# Altium schematic sheet DC075B_JESD_OUTPUT.SchDoc: JESD OUTPUT
size 558 x 431 mm; DrawnBy: Praveen Aroul; DocumentNumber: 11; SheetNumber: 11; SheetTotal: 13; PageSetup: Record=PageOptions|CenterHorizontal=True|CenterVertical=True|PrintScale=1.00|XCorrection=1.00|YCorrection=1.00|PrintKind=0|BorderSize=5000000|LeftOffset=0|BottomOffset=0|Orientation=2|PaperLength=1000|PaperWidth=1000|Scale=100|PaperSource=15|PrintQuality=600|MediaType=1|DitherType=10|PaperKind=Letter|PrintScaleMode=1
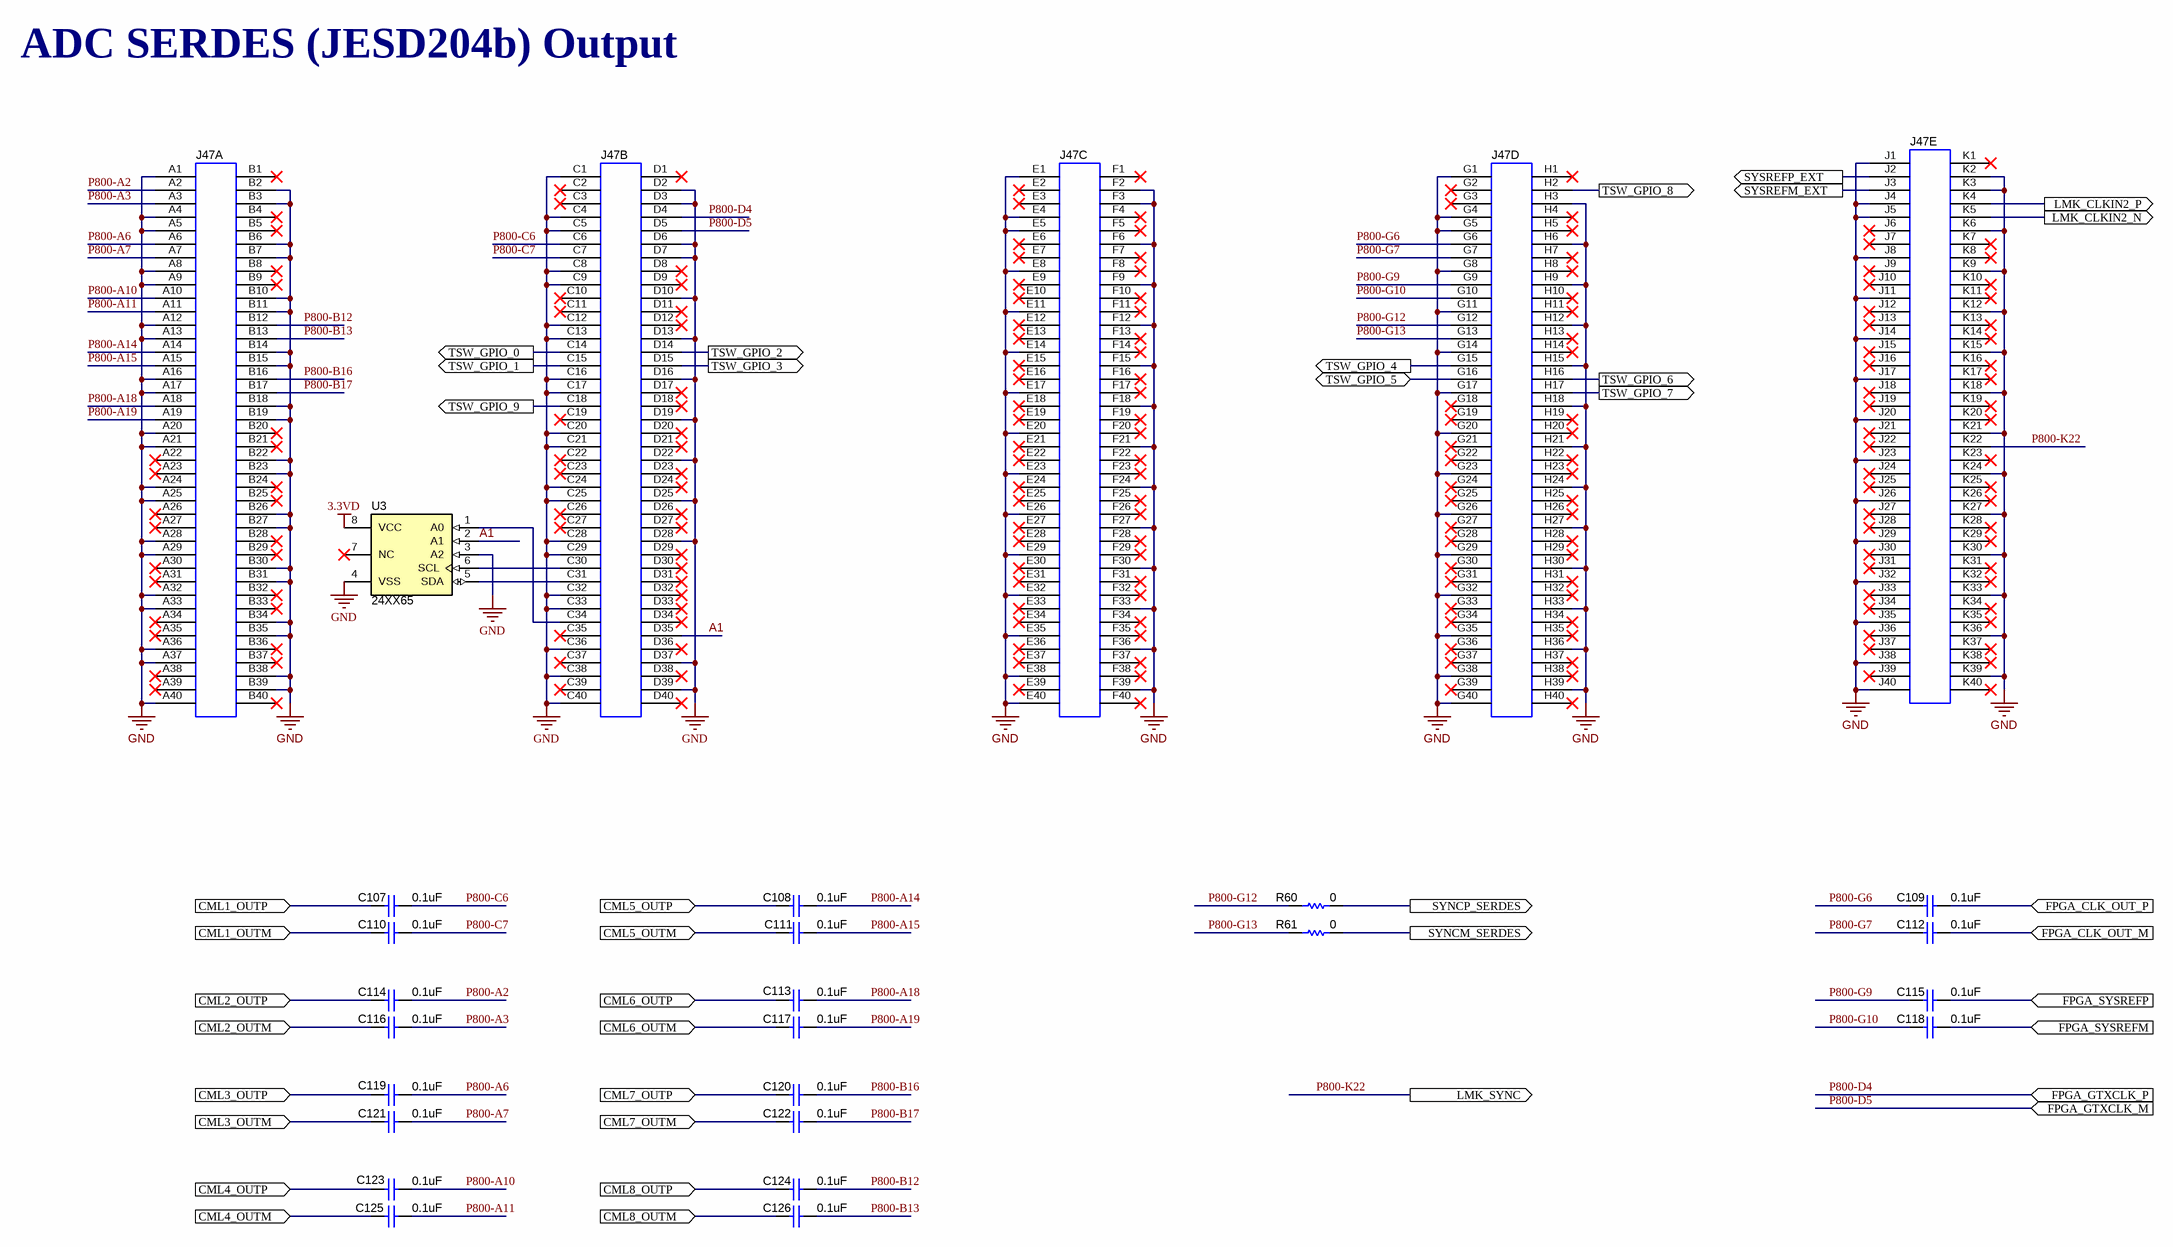
[diagram p0: DC075B_JESD_OUTPUT.SchDoc]

## Parts
C107  value 0.1uF  [0402]  (hidden comment: Capacitor)
C108  value 0.1uF  [0402]  (hidden comment: Capacitor)
C109  value 0.1uF  [0402]  (hidden comment: Capacitor)
C110  value 0.1uF  [0402]  (hidden comment: Capacitor)
C111  value 0.1uF  [0402]  (hidden comment: Capacitor)
C112  value 0.1uF  [0402]  (hidden comment: Capacitor)
C113  value 0.1uF  [0402]  (hidden comment: Capacitor)
C114  value 0.1uF  [0402]  (hidden comment: Capacitor)
C115  value 0.1uF  [0402]  (hidden comment: Capacitor)
C116  value 0.1uF  [0402]  (hidden comment: Capacitor)
C117  value 0.1uF  [0402]  (hidden comment: Capacitor)
C118  value 0.1uF  [0402]  (hidden comment: Capacitor)
C119  value 0.1uF  [0402]  (hidden comment: Capacitor)
C120  value 0.1uF  [0402]  (hidden comment: Capacitor)
C121  value 0.1uF  [0402]  (hidden comment: Capacitor)
C122  value 0.1uF  [0402]  (hidden comment: Capacitor)
C123  value 0.1uF  [0402]  (hidden comment: Capacitor)
C124  value 0.1uF  [0402]  (hidden comment: Capacitor)
C125  value 0.1uF  [0402]  (hidden comment: Capacitor)
C126  value 0.1uF  [0402]  (hidden comment: Capacitor)
J47  SAMTEC_ASP-134602-01  [SAMTEC_ASP-134602-01]  (value not drawn)  (parts A,B,C,D,E of 5)
R60  value 0  [0402]  (hidden comment: Resistor)
R61  value 0  [0402]  (hidden comment: Resistor)
U3  24XX65  [SOIC127P800X216-8N]

## Ports
CML1_OUTM (in), CML1_OUTP (in), CML2_OUTM (in), CML2_OUTP (in), CML3_OUTM (in), CML3_OUTP (in), CML4_OUTM (in), CML4_OUTP (in), CML5_OUTM (in), CML5_OUTP (in), CML6_OUTM (in), CML6_OUTP (in), CML7_OUTM (in), CML7_OUTP (in), CML8_OUTM (in), CML8_OUTP (in), FPGA_CLK_OUT_M (in), FPGA_CLK_OUT_P (in), FPGA_GTXCLK_M (in), FPGA_GTXCLK_P (in), FPGA_SYSREFM (in), FPGA_SYSREFP (in), LMK_CLKIN2_N (out), LMK_CLKIN2_P (out), LMK_SYNC (out), SYNCM_SERDES (out), SYNCP_SERDES (out), SYSREFM_EXT (out), SYSREFP_EXT (out), TSW_GPIO_0 (out), TSW_GPIO_1 (out), TSW_GPIO_2 (out), TSW_GPIO_3 (out), TSW_GPIO_4 (out), TSW_GPIO_5, TSW_GPIO_6 (out), TSW_GPIO_7 (out), TSW_GPIO_8 (out), TSW_GPIO_9 (out)

## Nets
3.3VD: U3.8(VCC)
GND: J47.A1 J47.A4 J47.A5 J47.A8 J47.A9 J47.A12 J47.A13 J47.A16 J47.A17 J47.A20 J47.A21 J47.A24 J47.A25 J47.A28 J47.A29 J47.A32 J47.A33 J47.A36 J47.A37 J47.A40 J47.B2 J47.B3 J47.B6 J47.B7 J47.B10 J47.B11 J47.B14 J47.B15 J47.B18 J47.B19 J47.B22 J47.B23 J47.B26 J47.B27 J47.B30 J47.B31 J47.B34 J47.B35 J47.B38 J47.B39 J47.C1 J47.C4 J47.C5 J47.C8 J47.C9 J47.C12 J47.C13 J47.C16 J47.C17 J47.C20 J47.C21 J47.C24 J47.C25 J47.C28 J47.C29 J47.C32 J47.C33 J47.C36 J47.C38 J47.C40 J47.D2 J47.D3 J47.D6 J47.D7 J47.D10 J47.D13 J47.D16 J47.D19 J47.D22 J47.D25 J47.D28 J47.D37 J47.D39 J47.E1 J47.E4 J47.E5 J47.E8 J47.E11 J47.E14 J47.E17 J47.E20 J47.E23 J47.E26 J47.E29 J47.E32 J47.E35 J47.E38 J47.E40 J47.F2 J47.F3 J47.F6 J47.F9 J47.F12 J47.F15 J47.F18 J47.F21 J47.F24 J47.F27 J47.F30 J47.F33 J47.F36 J47.F39 J47.G1 J47.G4 J47.G5 J47.G8 J47.G11 J47.G14 J47.G17 J47.G20 J47.G23 J47.G26 J47.G29 J47.G32 J47.G35 J47.G38 J47.G40 J47.H3 J47.H6 J47.H9 J47.H12 J47.H15 J47.H18 J47.H21 J47.H24 J47.H27 J47.H30 J47.H33 J47.H36 J47.H39 J47.J1 J47.J4 J47.J5 J47.J8 J47.J11 J47.J14 J47.J17 J47.J20 J47.J23 J47.J26 J47.J29 J47.J32 J47.J35 J47.J38 J47.J40 J47.K2 J47.K3 J47.K6 J47.K9 J47.K12 J47.K15 J47.K18 J47.K21 J47.K24 J47.K27 J47.K30 J47.K33 J47.K36 J47.K39 U3.3(A2) U3.4(VSS)
A1: J47.D35 U3.2(A1)
CML1_OUTM: C110.2 ; port CML1_OUTM
CML1_OUTP: C107.2 ; port CML1_OUTP
CML2_OUTM: C116.2 ; port CML2_OUTM
CML2_OUTP: C114.2 ; port CML2_OUTP
CML3_OUTM: C121.2 ; port CML3_OUTM
CML3_OUTP: C119.2 ; port CML3_OUTP
CML4_OUTM: C125.2 ; port CML4_OUTM
CML4_OUTP: C123.2 ; port CML4_OUTP
CML5_OUTM: C111.2 ; port CML5_OUTM
CML5_OUTP: C108.2 ; port CML5_OUTP
CML6_OUTM: C117.2 ; port CML6_OUTM
CML6_OUTP: C113.2 ; port CML6_OUTP
CML7_OUTM: C122.2 ; port CML7_OUTM
CML7_OUTP: C120.2 ; port CML7_OUTP
CML8_OUTM: C126.2 ; port CML8_OUTM
CML8_OUTP: C124.2 ; port CML8_OUTP
FPGA_CLK_OUT_M: C112.1 ; port FPGA_CLK_OUT_M
FPGA_CLK_OUT_P: C109.1 ; port FPGA_CLK_OUT_P
FPGA_SYSREFM: C118.1 ; port FPGA_SYSREFM
FPGA_SYSREFP: C115.1 ; port FPGA_SYSREFP
LMK_CLKIN2_N: J47.K5 ; port LMK_CLKIN2_N
LMK_CLKIN2_P: J47.K4 ; port LMK_CLKIN2_P
P800-A2: C114.1 J47.A2
P800-A3: C116.1 J47.A3
P800-A6: C119.1 J47.A6
P800-A7: C121.1 J47.A7
P800-A10: C123.1 J47.A10
P800-A11: C125.1 J47.A11
P800-A14: C108.1 J47.A14
P800-A15: C111.1 J47.A15
P800-A18: C113.1 J47.A18
P800-A19: C117.1 J47.A19
P800-B12: C124.1 J47.B12
P800-B13: C126.1 J47.B13
P800-B16: C120.1 J47.B16
P800-B17: C122.1 J47.B17
P800-C6: C107.1 J47.C6
P800-C7: C110.1 J47.C7
P800-D4: J47.D4 ; port FPGA_GTXCLK_P
P800-D5: J47.D5 ; port FPGA_GTXCLK_M
P800-G6: C109.2 J47.G6
P800-G7: C112.2 J47.G7
P800-G9: C115.2 J47.G9
P800-G10: C118.2 J47.G10
P800-G12: J47.G12 R60.1
P800-G13: J47.G13 R61.1
P800-K22: J47.K22 ; port LMK_SYNC
SYNCM_SERDES: R61.2 ; port SYNCM_SERDES
SYNCP_SERDES: R60.2 ; port SYNCP_SERDES
SYSREFM_EXT: J47.J3 ; port SYSREFM_EXT
SYSREFP_EXT: J47.J2 ; port SYSREFP_EXT
TSW_GPIO_0: J47.C14 ; port TSW_GPIO_0
TSW_GPIO_1: J47.C15 ; port TSW_GPIO_1
TSW_GPIO_2: J47.D14 ; port TSW_GPIO_2
TSW_GPIO_3: J47.D15 ; port TSW_GPIO_3
TSW_GPIO_4: J47.G15 ; port TSW_GPIO_4
TSW_GPIO_5: J47.G16 ; port TSW_GPIO_5
TSW_GPIO_6: J47.H16 ; port TSW_GPIO_6
TSW_GPIO_7: J47.H17 ; port TSW_GPIO_7
TSW_GPIO_8: J47.H2 ; port TSW_GPIO_8
TSW_GPIO_9: J47.C18 ; port TSW_GPIO_9
NetJ47_C30: J47.C30 U3.6(SCL)
NetJ47_C31: J47.C31 U3.5(SDA)
NetJ47_C34: J47.C34 U3.1(A0)

Not connected (* = marked no-connect by the designer): J47 A22* A23* A26* A27* A30* A31* A34* A35* A38* A39* B1* B4* B5* B8* B9* B20* B21* B24* B25* B28* B29* B32* B33* B36* B37* B40* C2* C3* C10* C11* C19* C22* C23* C26* C27* C35* C37* C39* D1* D8* D9* D11* D12* D17* D18* D20* D21* D23* D24* D26* D27* D29* D30* D31* D32* D33* D34* D36* D38* D40* E2* E3* E6* E7* E9* E10* E12* E13* E15* E16* E18* E19* E21* E22* E24* E25* E27* E28* E30* E31* E33* E34* E36* E37* E39* F1* F4* F5* F7* F8* F10* F11* F13* F14* F16* F17* F19* F20* F22* F23* F25* F26* F28* F29* F31* F32* F34* F35* F37* F38* F40* G2* G3* G18* G19* G21* G22* G24* G25* G27* G28* G30* G31* G33* G34* G36* G37* G39* H1* H4* H5* H7* H8* H10* H11* H13* H14* H19* H20* H22* H23* H25* H26* H28* H29* H31* H32* H34* H35* H37* H38* H40* J6* J7* J9* J10* J12* J13* J15* J16* J18* J19* J21* J22* J24* J25* J27* J28* J30* J31* J33* J34* J36* J37* J39* K1* K7* K8* K10* K11* K13* K14* K16* K17* K19* K20* K23* K25* K26* K28* K29* K31* K32* K34* K35* K37* K38* K40*; U3 7(NC)*

## Notes on the sheet
- ADC SERDES (JESD204b) Output
- Drawn By:
- SVN Rev:
- Number:
- TID #:
- Orderable:
- Rev:
- Sheet Title:
- File:
- Project Title:
- Designed for:
- Assembly Variant:
- Mod. Date:
- Sheet:
- Size:
- of
- C
- http://www.ti.com
- Texas Instruments and/or its licensors do not warrant the accuracy or completeness of this specification or any information contained therein. Texas Instruments and/or its licensors do not warrant that this design will meet the specifications, will be suitable for your application or fit for any particular purpose, or will operate in an implementation. Texas Instruments and/or its licensors do not warrant that the design is production worthy. You should completely validate and test your design implementation to confirm the system functionality for your application.
- Engineer:
- Contact:
- © Texas Instruments

## Library data of the parts
C107-C126 = CMP-0006641-2: CAP, CERM, 0.1 uF, 16 V, +/- 10%, X7R, 0402; PartNumber: GRM155R71C104KA88D; Manufacturer: MuRata; Polarized: N; U/M: EA; Cap_F: 100nF; Value1: Unknown; VDC_V: 16V; TaMin_C: -55°C; TaMax_C: 125°C; AEC Category: Q200; SizeArea_mm2: 0.5; SizeAreaWB_mm2: 3; SizeX_mm: 1; SizeZ_mm: 0.6; CompType: Capacitor; ValueDisplayed: 0.1uF; PackageReference: 0402; RoHS: Y; Tolerance_%: 10%; Value2: 16V; MountType: SMT; Technology: Ceramic; TempCo: X7R; Cap_Case: 0402; Published: 2008-06-19; Publisher: Texas Instruments; LatestRevisionDate: 2017-03-09; ComponentLink1Description: Datasheet link; ComponentLink1URL: http://search.murata.co.jp/Ceramy/PnsearchViewAction.do?HnOFG=ON&HnNFG=ON&SEL_CNT=50&sLang=en&sKey=GRM155R71C104KA88D&x=9&y=9&search=startwith; Supplier 1: Digi-Key; Supplier Part Number 1: 490-3261-1-ND; Supplier 2: Newark; Supplier Part Number 2: 38K1647; Supplier 3: Mouser; Supplier Part Number 3: 81-GRM155R71C104KA88; AEC Qualified: ?; SizeY_mm: 0.5
J47 = CMP-0056027-1: Connector, Male, 1.27 mm, 40x4, SMD; Manufacturer: Samtec; CNHeader: FALSE; PartNumber: ASP-134602-01; PackageReference: Connector, Male, 1.27 mm, 40x4, SMD; CompType: Connector; RoHS: Y; MountType: SMT; ComponentLink1Description: Datasheet URL; ComponentLink1URL: http://www.samtec.com/documents/webfiles/Cpdf/ASP-134602-01-mkt.pdf; Publisher: Texas Instruments; LatestRevisionDate: 26/05/2017; Supplier 1: Digi-Key; Supplier Part Number 1: SAM8731-ND; Supplier 2: Farnell; Supplier Part Number 2: 2433505; CT: FALSE
R60 R61 = CMP-0026822-3: RES, 0, 5%, 0.063 W, AEC-Q200 Grade 0, 0402; Manufacturer: Vishay-Dale; PartNumber: CRCW04020000Z0ED; Value_Code: 0000; Power_W: 63mW; Value2: 0.063W; VDC_V: 50V; TempCo: 200 ppm/C; EIA_Code: E24; AEC Category: Q200; AEC Qualified: Y; SizeArea_mm2: 0.5; SizeX_mm: 1; SizeZ_mm: 0.6; ComponentLink1Description: Datasheet link; ComponentLink1URL: http://www.vishay.com/docs/20035/dcrcwe3.pdf; CompType: Resistor; MountType: SMT; PackageReference: 0402; RoHS: E; ValueDisplayed: 0; Res_ohm: 0; Tolerance_%: 5%; Value1: 5%; Technology: Thick Film; Supplier 1: Digi-Key; Supplier Part Number 1: 541-0.0JCT-ND; Supplier 2: Newark; Supplier Part Number 2: 52K6543; Supplier 3: Mouser; Supplier Part Number 3: 71-CRCW0402-0-E3; AEC Grade: 0; SizeY_mm: 0.5
U3 = CMP-0005258-2: 64K I2C Smart Serial EEPROM, SOIC-8; PartNumber: 24LC65-I/SM; Manufacturer: Microchip; MountType: SMT; ComponentLink1Description: Datasheet URL; ComponentLink1URL: http://ww1.microchip.com/downloads/en/DeviceDoc/21073K.pdf; RoHS: Y; PackageReference: SOIC-8, 208mil wide; Publisher: Texas Instruments; LatestRevisionDate: 09/03/2017; Supplier 1: Digi-Key; Supplier Part Number 1: 24LC65-I/SM-ND; Supplier 2: Newark; Supplier Part Number 2: 89C9816; Supplier 3: Mouser; Supplier Part Number 3: 579-24LC65-I/SM